# EAGLE design LED_1_1 (EAGLE 8.3.2)
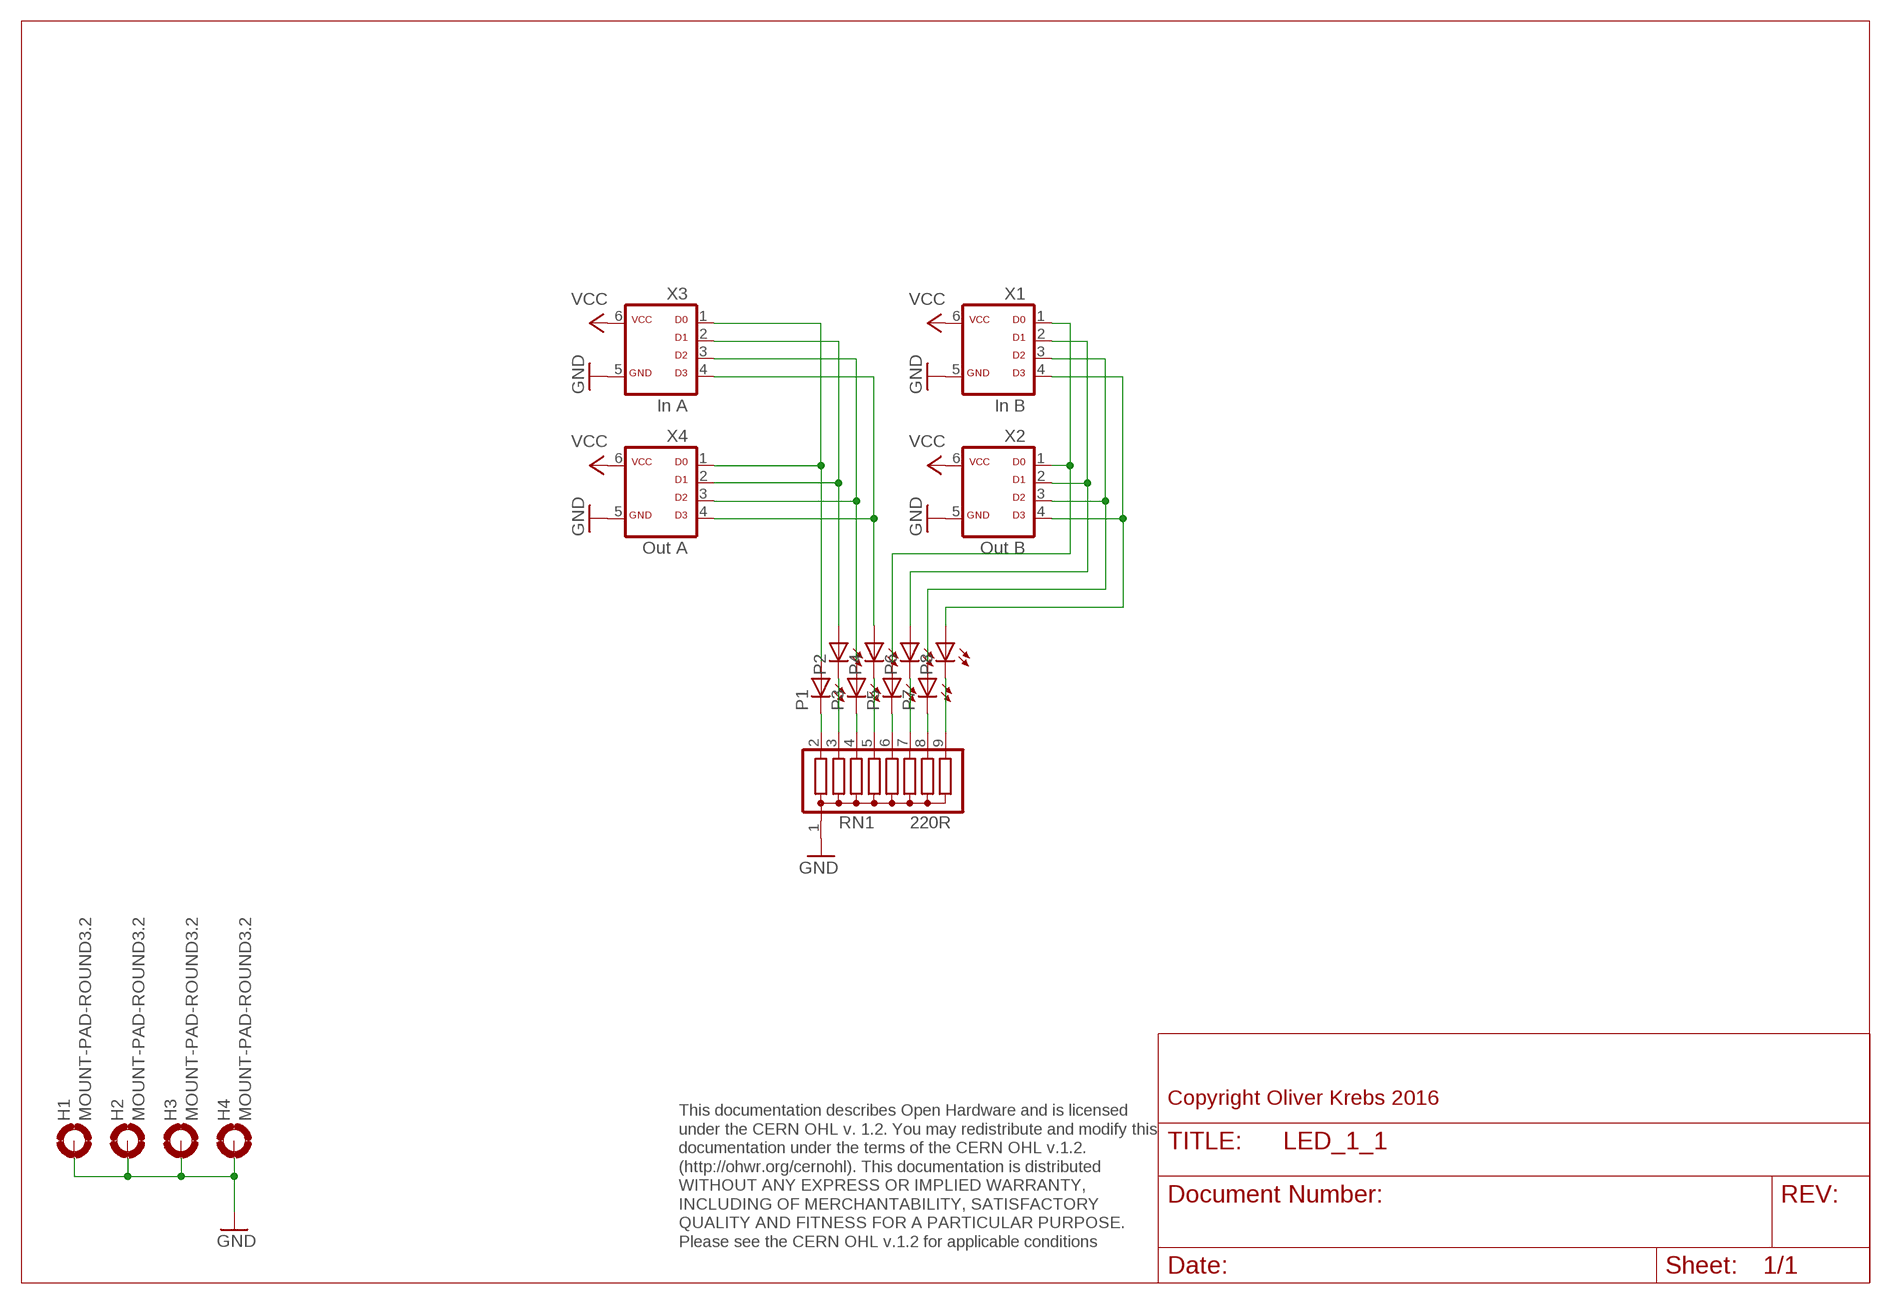
[diagram p0: schematic, sheet 1]

## Parts
H1  MOUNT-PAD-ROUND3.2  [3,2-PAD]
H2  MOUNT-PAD-ROUND3.2  [3,2-PAD]
H3  MOUNT-PAD-ROUND3.2  [3,2-PAD]
H4  MOUNT-PAD-ROUND3.2  [3,2-PAD]
P1  LED3MM  [LED3MM]
P2  LED3MM  [LED3MM]
P3  LED3MM  [LED3MM]
P4  LED3MM  [LED3MM]
P5  LED3MM  [LED3MM]
P6  LED3MM  [LED3MM]
P7  LED3MM  [LED3MM]
P8  LED3MM  [LED3MM]
RN1  220R  G08R  [SIL9]
X1  In B  ML6D  [ML-6]
X2  Out B  ML6D  [ML-6]
X3  In A  ML6D  [ML-6]
X4  Out A  ML6D  [ML-6]

## Nets
GND: H1.B3,2(MOUNT) H2.B3,2(MOUNT) H3.B3,2(MOUNT) H4.B3,2(MOUNT) RN1.1 X1.5 X2.5 X3.5 X4.5
N$1: P5.A X1.1 X2.1
N$2: P6.A X1.2 X2.2
N$3: P1.A X3.1 X4.1
N$4: P8.A X1.4 X2.4
N$6: P5.K(C) RN1.6
N$7: P7.A X1.3 X2.3
N$8: P2.A X3.2 X4.2
N$9: P4.A X3.4 X4.4
N$10: P3.A X3.3 X4.3
N$11: P6.K(C) RN1.7
N$12: P7.K(C) RN1.8
N$14: P4.K(C) RN1.5
N$15: P3.K(C) RN1.4
N$16: P2.K(C) RN1.3
N$17: P1.K(C) RN1.2
P6: P8.K(C) RN1.9
VCC: X1.6 X2.6 X3.6 X4.6

## Notes on the sheet
- Copyright Oliver Krebs 2016
- This documentation describes Open Hardware and is licensed 
  under the CERN OHL v. 1.2. You may redistribute and modify this 
  documentation under the terms of the CERN OHL v.1.2. 
  (http://ohwr.org/cernohl). This documentation is distributed
  WITHOUT ANY EXPRESS OR IMPLIED WARRANTY, 
  INCLUDING OF MERCHANTABILITY, SATISFACTORY 
  QUALITY AND FITNESS FOR A PARTICULAR PURPOSE. 
  Please see the CERN OHL v.1.2 for applicable conditions

## Library data of the parts
H1-H4 = holes:MOUNT-PAD-ROUND: MOUNTING PAD, round
P1-P8 = 01-my-led:LED: LED OSRAM: - CHIPLED LG R971, LG N971, LY N971, LG Q971, LY Q971, LO R971, LY R971 LH N974, LH R974 LS Q976, LO Q976, LY Q976 LO Q996 - Hyper CHIPLED LW Q18S LB Q993, LB Q99A, LB R99A - SideLED LS A670, LO A670, LY A670, LG A670, LP A670 LB A673, LV A673, LT A673, LW A673 LH A674 LY A675 LS A676, LA A676, LO A676, LY A676, LW A676 LS A679, LY A679, LG A679 - Hyper Micro SIDELED® LS Y876, LA Y876, LO Y876, LY Y876 LT Y87S - SmartLED LW L88C, LW L88S LB L89C, LB L89S, LG L890 LS L89K, LO L89K, LY L89K LS L896, LA L896, LO L896, LY L896 - TOPLED LS T670, LO T670, LY T670, LG T670, LP T670 LSG T670, LSP T670, LSY T670, LOP T670, LYG T670 LG T671, LOG T671, LSG T671 LB T673, LV T673, LT T673, LW T673 LH T674 LS T676, LA T676, LO T676, LY T676, LB T676, LH T676, LSB T676, LW T676 LB T67C, LV T67C, LT T67C, LS T67K, LO T67K, LY T67K, LW E67C LS E67B, LA E67B, LO E67B, LY E67B, LB E67C, LV E67C, LT E67C LW T67C LS T679, LY T679, LG T679 LS T770, LO T770, LY T770, LG T770, LP T770 LB T773, LV T773, LT T773, LW T773 LH T774 LS E675, LA E675, LY E675, LS T675 LS T776, LA T776, LO T776, LY T776, LB T776 LHGB T686 LT T68C, LB T68C - Hyper Mini TOPLED® LB M676 - Mini TOPLED Santana® LG M470 LS M47K, LO M47K, LY M47K Source: http://www.osram.convergy.de LUXEON: - LUMILED® LXK2-PW12-R00, LXK2-PW12-S00, LXK2-PW14-U00, LXK2-PW14-V00 LXK2-PM12-R00, LXK2-PM12-S00, LXK2-PM14-U00 LXK2-PE12-Q00, LXK2-PE12-R00, LXK2-PE12-S00, LXK2-PE14-T00, LXK2-PE14-U00 LXK2-PB12-K00, LXK2-PB12-L00, LXK2-PB12-M00, LXK2-PB14-N00, LXK2-PB14-P00, LXK2-PB14-Q00 LXK2-PR12-L00, LXK2-PR12-M00, LXK2-PR14-Q00, LXK2-PR14-R00 LXK2-PD12-Q00, LXK2-PD12-R00, LXK2-PD12-S00 LXK2-PH12-R00, LXK2-PH12-S00 LXK2-PL12-P00, LXK2-PL12-Q00, LXK2-PL12-R00 Source: www.luxeon.com KINGBRIGHT: KA-3528ASYC Source: www.kingbright.com
RN1 = resistor-sil:G08R: SIL RESISTOR; OC_FARNELL: unknown; OC_NEWARK: unknown
X1-X4 = 01-my-con:ML6D

## Board
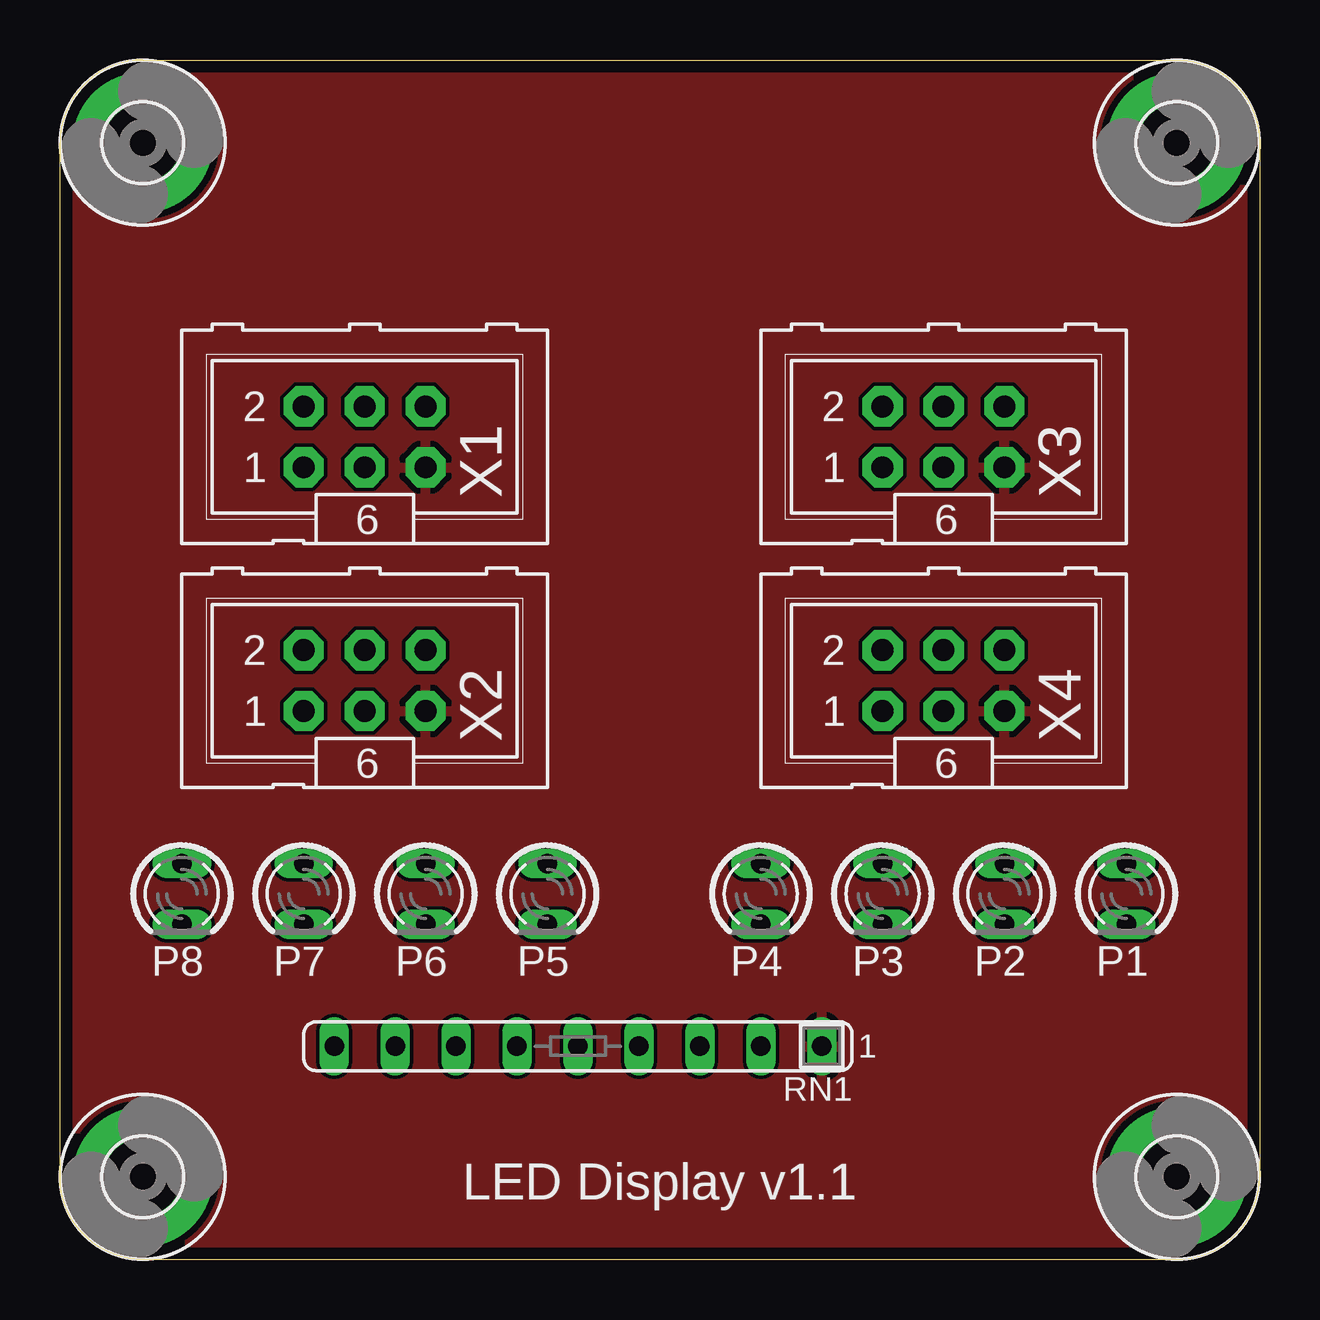
[diagram p1: board, top side]
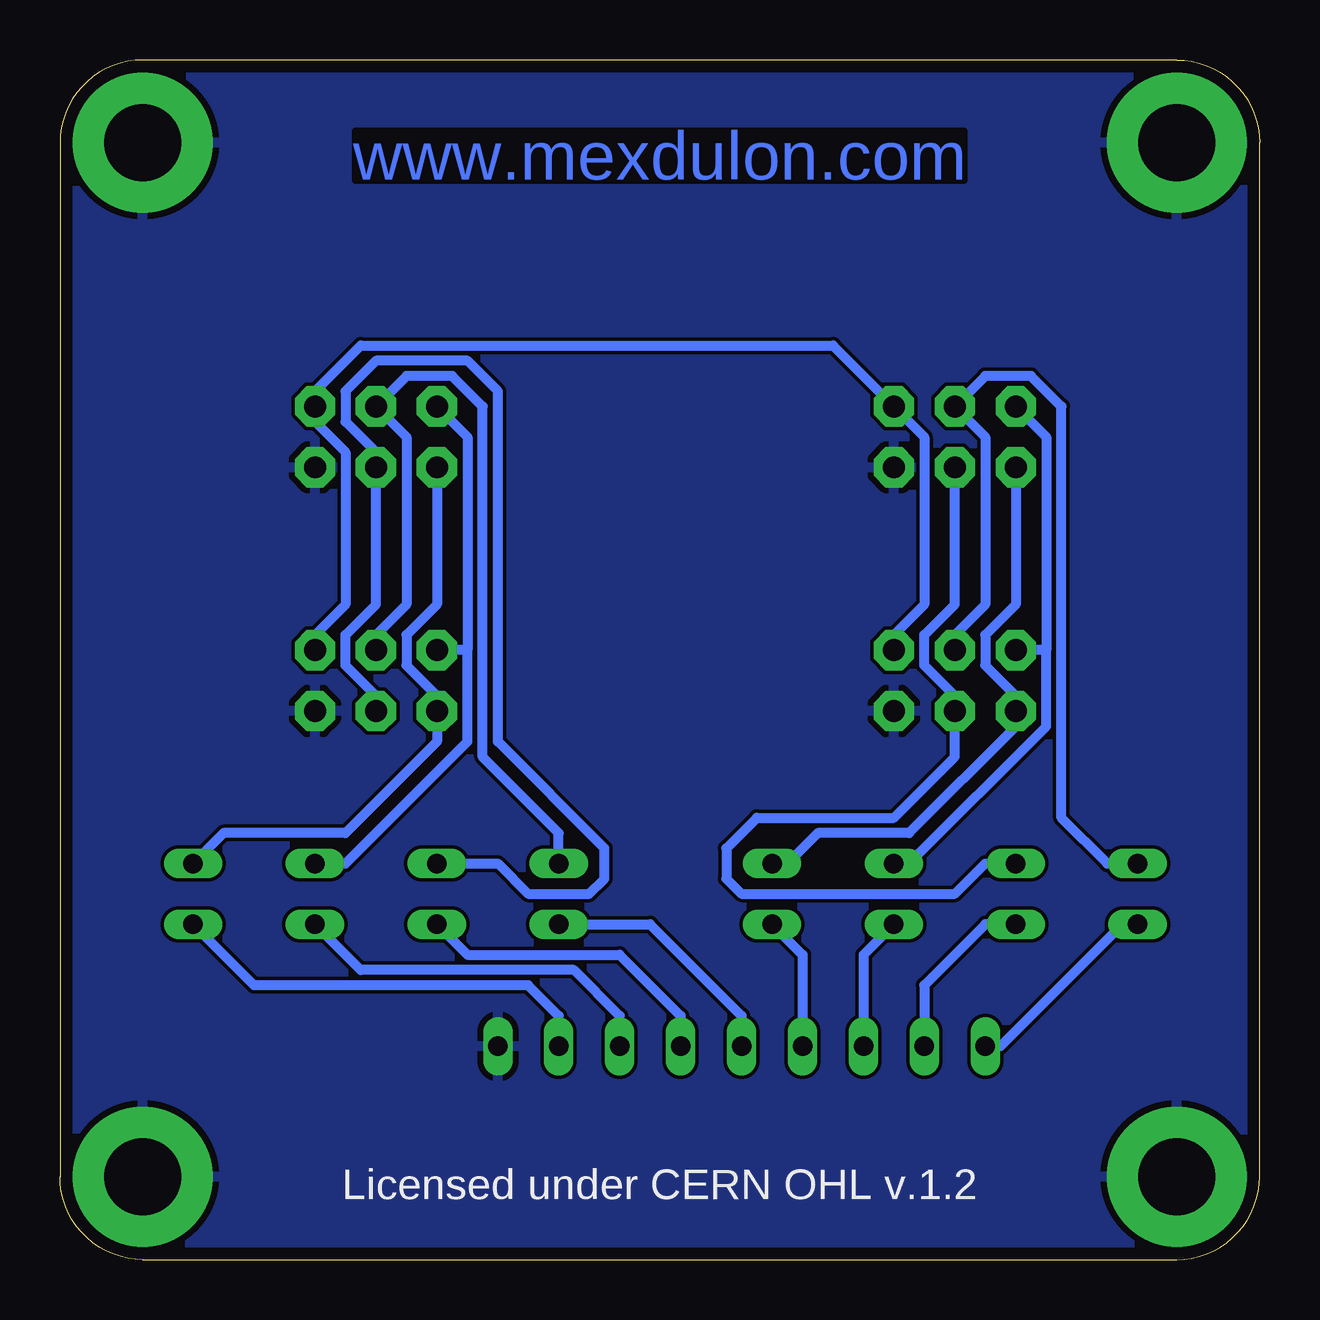
[diagram p2: board, bottom side, seen from below]

Size 50 x 50 mm. Coordinates in mm from the lower left corner, seen from the top.
Outline: 0,3.45 0,46.55 arc-90 3.45,50 46.55,50 arc-90 50,46.55 50,3.45 arc-90 46.55,0 3.45,0 arc-90 0,3.45
Copper layers (1*16): Top 0.035mm / dielectric 1.6mm / Bottom 0.035mm
Design rules "Elecrow_2-layer_PCB_eagle_rule": minimum track width 6mil, minimum drill 12mil, track to track 6mil, track to pad 6mil, pad to pad 6mil, via to via 8mil, smd to smd 0mil, copper to edge 20mil, drill to drill 10mil, minimum pad ring 6mil, minimum via ring 6mil, stop-mask expansion 0mil, vias tented up to drill 100mil, thermal gap 10mil

### Footprints (pad centres in the part's own frame; a part is rotated, then mirrored left to right if it is on the bottom)
3,2-PAD = drill 3.2 pad 5.842: B3,2 0,0
LED3MM = drill 0.813 long: A -1.27,0; K 1.27,0
SIL9 = drill 0.813 long: 1 -10.16,0; 2 -7.62,0; 3 -5.08,0; 4 -2.54,0; 5 0,0; 6 2.54,0; 7 5.08,0; 8 7.62,0; 9 10.16,0
ML-6 = drill 0.914 pad 1.676 octagon: 1 -2.54,-1.27; 2 -2.54,1.27; 3 0,-1.27; 4 0,1.27; 5 2.54,-1.27; 6 2.54,1.27

### Placement (x,y rotation side)
H1  3.45,3.45 0 top
H2  3.45,46.55 0 top
H3  46.55,46.55 0 top
H4  46.55,3.45 0 top
P1  44.45,15.24 270 top
P2  39.37,15.24 270 top
P3  34.29,15.24 270 top
P4  29.21,15.24 270 top
P5  20.32,15.24 270 top
P6  15.24,15.24 270 top
P7  10.16,15.24 270 top
P8  5.08,15.24 270 top
RN1  21.59,8.89 180 top
X1  12.7,34.29 0 top
X2  12.7,24.13 0 top
X3  36.83,34.29 0 top
X4  36.83,24.13 0 top

### Tracks (layer width: path | path; a pad name or v marks a point on that pad's centre or on a via)
GND
  pour Bottom: 0,0 50.16,0 50.16,50.16 0,50.16
  pour Top: 0,50.16 50.16,50.16 50.16,0 0,0
N$1
  Bottom 0.406: X1.1 10.16,27.3 11.43,26.04 11.43,24.77 10.16,23.5 X2.1 10.16,22.23 14.61,17.78 18.41,17.78 19.68,16.51 P5.A
N$2
  Bottom 0.406: X1.2 8.89,34.29 8.89,25.4 | 8.89,25.4 X2.2 | P6.A 14.61,16.51 8.89,22.23 8.89,25.4
N$3
  Bottom 0.406: P1.A 43.18,17.78 38.1,17.78 34.29,21.59 X4.1 34.29,23.5 35.56,24.77 35.56,26.04 34.29,27.3 X3.1
N$4
  Bottom 0.406: X2.4 12.7,26.04 11.43,27.3 11.43,34.29 X1.4 11.43,36.83 9.53,36.83 8.26,35.56 8.26,18.41 6.35,16.51 P8.A
N$6
  Bottom 0.406: P5.K 19.05,12.7 RN1.6
N$7
  Bottom 0.406: X1.3 12.7,27.3 13.97,26.04 13.97,24.77 12.7,23.5 X2.3 12.7,20.95 15.24,18.41 20.95,18.41 22.23,17.14 22.23,15.88 21.59,15.24 12.7,15.24 11.43,16.51 P7.A
N$8
  Bottom 0.406: X3.2 33.02,34.29 33.02,25.4 | P2.A 38.1,16.51 33.02,21.59 33.02,25.4 | 33.02,25.4 X4.2
N$9
  Bottom 0.406: X4.4 36.83,26.04 35.56,27.3 35.56,34.29 X3.4 35.56,36.83 33.66,36.83 32.38,35.56 32.38,20.95 29.21,17.78 P4.A
N$10
  Bottom 0.406: P3.A 31.75,16.51 30.48,15.24 27.94,15.24 27.3,15.88 27.3,17.14 31.75,21.59 31.75,36.2 33.02,37.47 36.83,37.47 38.1,36.2 38.1,34.92 36.83,33.66 X3.3 36.83,27.3 38.1,26.04 38.1,24.77 36.83,23.5 X4.3
N$11
  Bottom 0.406: P6.K 16.51,12.7 RN1.7
N$12
  Bottom 0.406: P7.K 11.43,13.97 13.97,11.43 RN1.8
N$14
  Bottom 0.406: P4.K 25.4,13.97 21.59,10.16 RN1.5
N$15
  Bottom 0.406: RN1.4 24.13,10.16 26.67,12.7 33.02,12.7 P3.K
N$16
  Bottom 0.406: RN1.3 26.67,10.16 28.57,12.06 37.47,12.06 P2.K
N$17
  Bottom 0.406: P1.K 41.91,11.43 30.48,11.43 29.21,10.16 RN1.2
P6
  Bottom 0.406: P8.K 5.71,13.97 10.79,8.89 RN1.9
VCC
  Bottom 0.406: X4.6 39.37,26.04 38.1,27.3 38.1,33.66 39.37,34.92 X3.6 39.37,36.2 37.47,38.1 17.78,38.1 X1.6 13.97,34.29 13.97,27.3 15.24,26.04 X2.6

### Text on the board
Bottom: www.mexdulon.com
tNames: LED Display v1.1
bNames: Licensed under CERN OHL v.1.2